# Altium schematic sheet AMP_P1.schDoc
size A; SheetNumber: 3; SheetTotal: 6
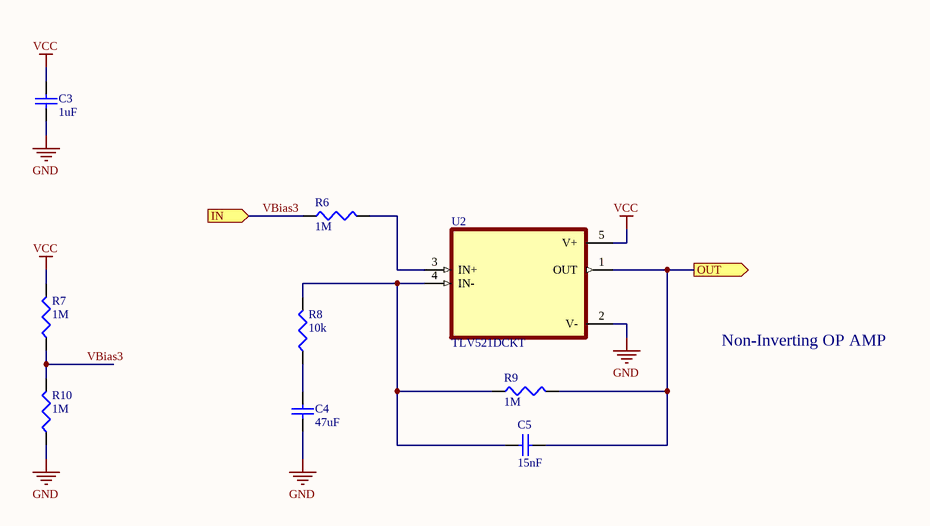
[diagram p0: AMP_P1.schDoc]

## Parts
C3  1uF  [SMD-0603]
C4  47uF  [SMD-0603]
C5  15nF  [SMD-0603]
R6  1M  [SMD-0603]
R7  1M  [SMD-0603]
R8  10k  [SMD-0603]
R9  1M  [SMD-0603]
R10  1M  [SMD-0603]
U2  TLV521DCKT  [TLV521-SOT-5N]

## Ports
IN (in), OUT (out)

## Nets
GND: C3.1 C4.1 R10.1 U2.2(V-)
VCC: C3.2 R7.2 U2.5(V+)
OUT: C5.2 R9.2 U2.1(OUT) ; port OUT
VBias3: R6.1 R7.1 R10.2 ; port IN
NetC4_2: C4.2 R8.1
NetC5_1: C5.1 R8.2 R9.1 U2.4(IN-)
NetR6_2: R6.2 U2.3(IN+)

## Notes on the sheet
- Non-Inverting OP AMP

## Library data of the parts
C3-C5 = CAP0603: Ceramic Capacitor 0603
R6-R10 = RES0603: Resistor-0603
U2 = TLV521DCKT: 350-nA Nanopower, Single, RRIO, CMOS Input, Operational Amplifier for Cost-Sensitive Systems 5-SC70 -40 to 125; MF: Texas Instruments; DigiKey-Purchase-URL: https://snapeda.com/shop?store=DigiKey&id=809196; Package: SOT-SC70-5 Texas Instruments; Mouser-Purchase-URL: https://snapeda.com/shop?store=Mouser&id=809196; Value: *; Arrow_Electronics-Purchase-URL: https://snapeda.com/shop?store=Arrow+Electronics&id=809196; Texas_Instruments-Purchase-URL: https://snapeda.com/shop?store=Texas+Instruments&id=809196; SnapEDA_Link: https://www.snapeda.com/parts/TLV521DCKT/Texas%20Instruments/view-part/809196/?ref=snap; Availability: Unavailable; Price: None; MP: TLV521DCKT